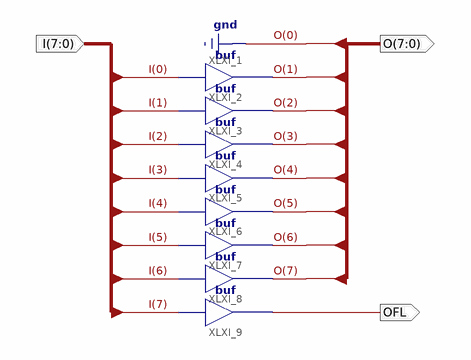
[diagram p0: schematic sheet 1]
// Xilinx ISE schematic lshift8x1b.sch (spartan6) as structural Verilog: 8 symbols, 3 ports
module lshift8x1b (
  input  [7:0] I,
  output [7:0] O,
  output OFL
);

  buf XLXI_2 (O[1], I[0]);
  buf XLXI_3 (O[2], I[1]);
  buf XLXI_4 (O[3], I[2]);
  buf XLXI_5 (O[4], I[3]);
  buf XLXI_6 (O[5], I[4]);
  buf XLXI_7 (O[6], I[5]);
  buf XLXI_8 (O[7], I[6]);
  buf XLXI_9 (OFL, I[7]);

  assign O[0] = 1'b0;
endmodule
